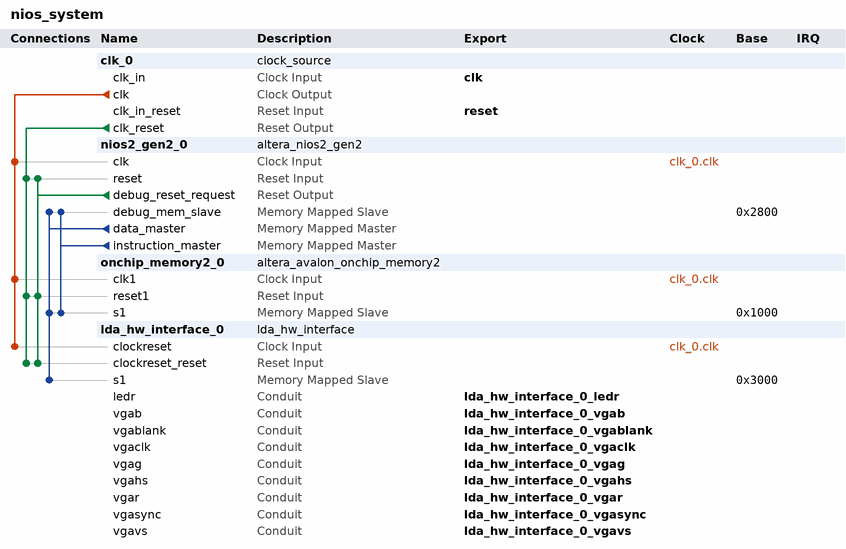
[diagram p0: system contents]
# Platform Designer (Qsys) system nios_system, Cyclone V 5CSEMA5F31C6
# Parameters at their usual value, and those the tool derives, are not listed.
package require -exact qsys 16.0
create_system nios_system
set_project_property DEVICE_FAMILY {Cyclone V}
set_project_property DEVICE 5CSEMA5F31C6

add_instance clk_0 clock_source 16.0
set_instance_parameter_value clk_0 clockFrequency 50000000

add_instance nios2_gen2_0 altera_nios2_gen2 16.0
set_instance_parameter_value nios2_gen2_0 dcache_size 2048
set_instance_parameter_value nios2_gen2_0 exceptionSlave onchip_memory2_0.s1
set_instance_parameter_value nios2_gen2_0 icache_size 4096
set_instance_parameter_value nios2_gen2_0 impl Tiny
set_instance_parameter_value nios2_gen2_0 resetSlave onchip_memory2_0.s1

add_instance onchip_memory2_0 altera_avalon_onchip_memory2 16.0
set_instance_parameter_value onchip_memory2_0 dataWidth 32
set_instance_parameter_value onchip_memory2_0 dualPort false
set_instance_parameter_value onchip_memory2_0 initMemContent true
set_instance_parameter_value onchip_memory2_0 initializationFileName onchip_mem.hex
set_instance_parameter_value onchip_memory2_0 memorySize 4096

add_instance lda_hw_interface_0 lda_hw_interface 1.0

# connections
add_connection clk_0.clk lda_hw_interface_0.clockreset clock
add_connection clk_0.clk nios2_gen2_0.clk clock
add_connection clk_0.clk onchip_memory2_0.clk1 clock
add_connection clk_0.clk_reset lda_hw_interface_0.clockreset_reset reset
add_connection clk_0.clk_reset nios2_gen2_0.reset reset
add_connection clk_0.clk_reset onchip_memory2_0.reset1 reset
add_connection nios2_gen2_0.debug_reset_request lda_hw_interface_0.clockreset_reset reset
add_connection nios2_gen2_0.debug_reset_request nios2_gen2_0.reset reset
add_connection nios2_gen2_0.debug_reset_request onchip_memory2_0.reset1 reset
add_connection nios2_gen2_0.data_master lda_hw_interface_0.s1 avalon
set_connection_parameter_value nios2_gen2_0.data_master/lda_hw_interface_0.s1 baseAddress 0x3000
add_connection nios2_gen2_0.data_master nios2_gen2_0.debug_mem_slave avalon
set_connection_parameter_value nios2_gen2_0.data_master/nios2_gen2_0.debug_mem_slave baseAddress 0x2800
add_connection nios2_gen2_0.data_master onchip_memory2_0.s1 avalon
set_connection_parameter_value nios2_gen2_0.data_master/onchip_memory2_0.s1 baseAddress 0x1000
add_connection nios2_gen2_0.instruction_master nios2_gen2_0.debug_mem_slave avalon
set_connection_parameter_value nios2_gen2_0.instruction_master/nios2_gen2_0.debug_mem_slave baseAddress 0x2800
add_connection nios2_gen2_0.instruction_master onchip_memory2_0.s1 avalon
set_connection_parameter_value nios2_gen2_0.instruction_master/onchip_memory2_0.s1 baseAddress 0x1000

# exported interfaces
add_interface clk clock sink
set_interface_property clk EXPORT_OF clk_0.clk_in
add_interface lda_hw_interface_0_ledr conduit end
set_interface_property lda_hw_interface_0_ledr EXPORT_OF lda_hw_interface_0.ledr
add_interface lda_hw_interface_0_vgab conduit end
set_interface_property lda_hw_interface_0_vgab EXPORT_OF lda_hw_interface_0.vgab
add_interface lda_hw_interface_0_vgablank conduit end
set_interface_property lda_hw_interface_0_vgablank EXPORT_OF lda_hw_interface_0.vgablank
add_interface lda_hw_interface_0_vgaclk conduit end
set_interface_property lda_hw_interface_0_vgaclk EXPORT_OF lda_hw_interface_0.vgaclk
add_interface lda_hw_interface_0_vgag conduit end
set_interface_property lda_hw_interface_0_vgag EXPORT_OF lda_hw_interface_0.vgag
add_interface lda_hw_interface_0_vgahs conduit end
set_interface_property lda_hw_interface_0_vgahs EXPORT_OF lda_hw_interface_0.vgahs
add_interface lda_hw_interface_0_vgar conduit end
set_interface_property lda_hw_interface_0_vgar EXPORT_OF lda_hw_interface_0.vgar
add_interface lda_hw_interface_0_vgasync conduit end
set_interface_property lda_hw_interface_0_vgasync EXPORT_OF lda_hw_interface_0.vgasync
add_interface lda_hw_interface_0_vgavs conduit end
set_interface_property lda_hw_interface_0_vgavs EXPORT_OF lda_hw_interface_0.vgavs
add_interface reset reset sink
set_interface_property reset EXPORT_OF clk_0.clk_in_reset

set_interconnect_requirement {$system} qsys_mm.clockCrossingAdapter HANDSHAKE
set_interconnect_requirement {$system} qsys_mm.enableEccProtection FALSE
set_interconnect_requirement {$system} qsys_mm.insertDefaultSlave FALSE
set_interconnect_requirement {$system} qsys_mm.maxAdditionalLatency 1

save_system nios_system.qsys
